# EAGLE schematic avr-atmega328p-pth (EAGLE 9.5.2)
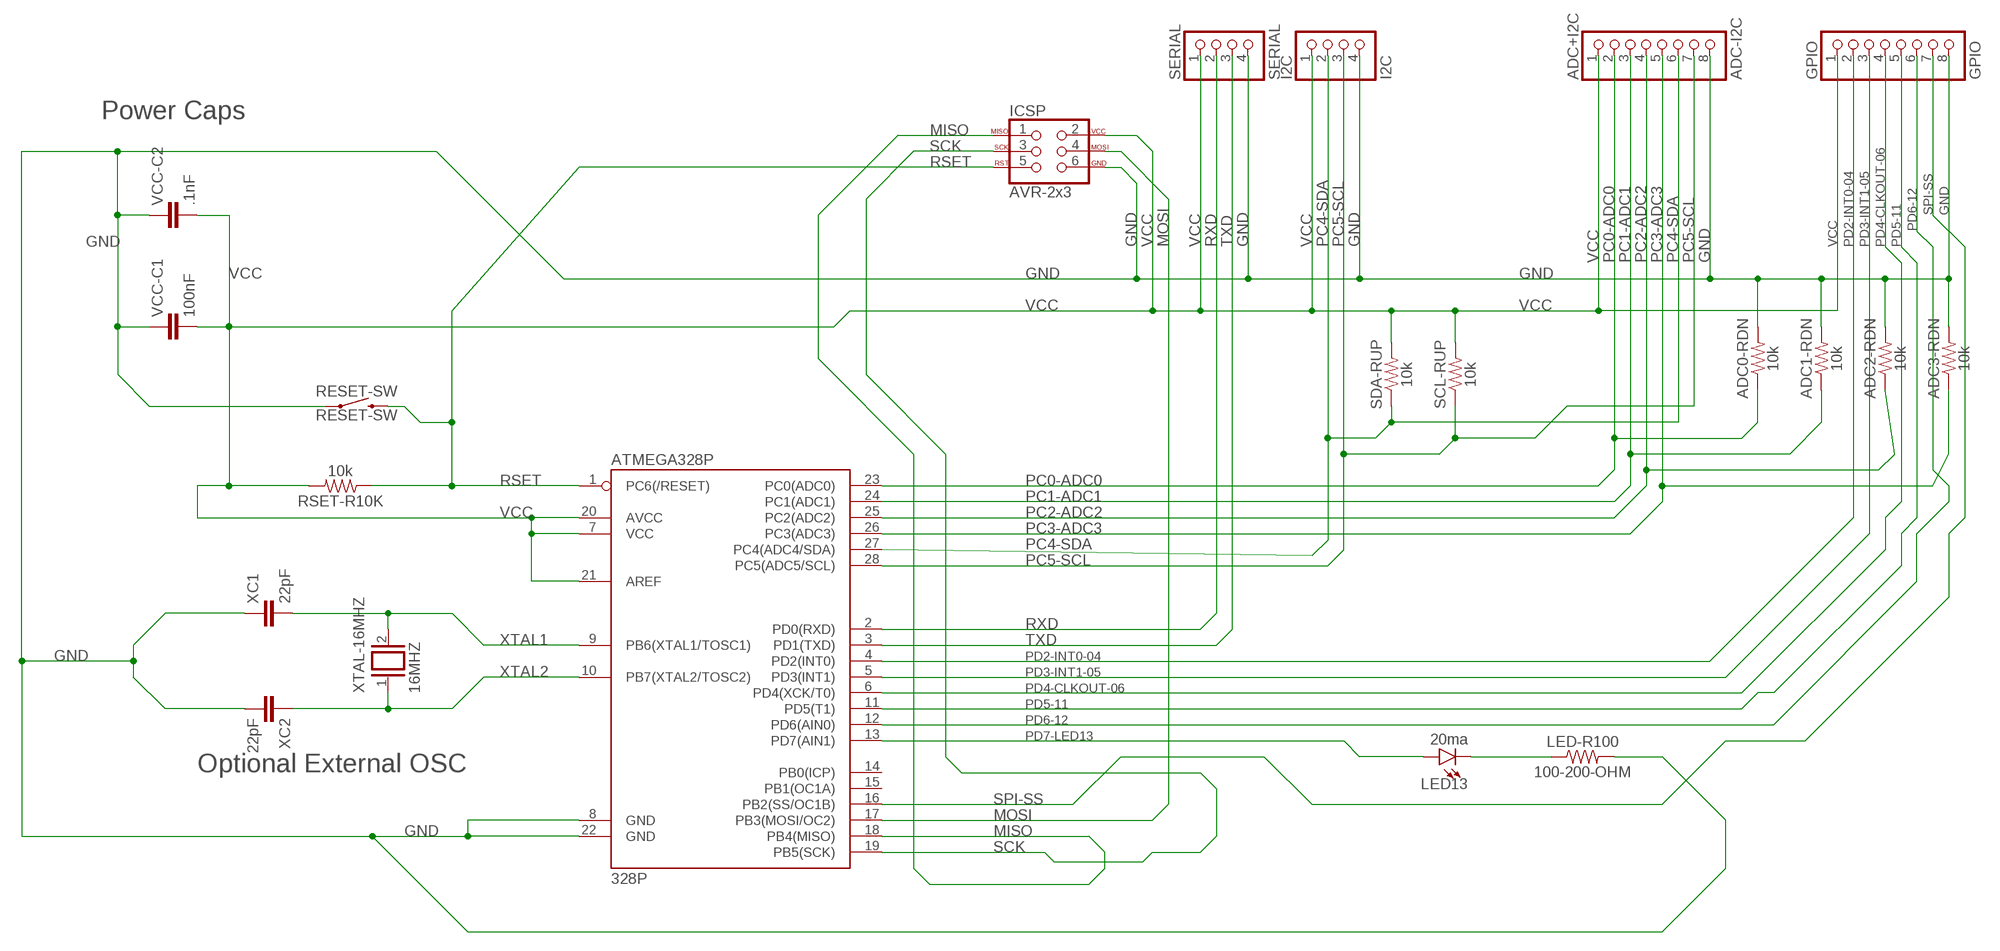
[diagram p0: schematic, sheet 1]

## Parts
ADC0-RDN  10k  10KOHM-HORIZ-1/4W-5%  [AXIAL-0.3]
ADC1-RDN  10k  10KOHM-HORIZ-1/4W-5%  [AXIAL-0.3]
ADC2-RDN  10k  10KOHM-HORIZ-1/4W-5%  [AXIAL-0.3]
ADC3-RDN  10k  10KOHM-HORIZ-1/4W-5%  [AXIAL-0.3]
ADC+I2C  ADC-I2C  PINHD-1X8  [1X08]
ATMEGA328P  328P  ATMEGA328P_PDIP  [DIP28]
GPIO  GPIO  PINHD-1X8  [1X08]
I2C  I2C  PINHD-1X4  [1X04]
ICSP  AVR-2x3  AVR_SPI_PROG_3X22X3_LOCK  [2X3_LOCK]
LED13  20ma  LED3MM  [LED_3MM]
LED-R100  100-200-OHM  10KOHM-HORIZ-1/4W-5%  [AXIAL-0.3]
RESET-SW  RESET-SW  MOMENTARY-SWITCH-SPST-PTH-6.0MM  [TACTILE_SWITCH_PTH_6.0MM]
RSET-R10K  10k  10KOHM-HORIZ-1/4W-5%  [AXIAL-0.3]
SCL-RUP  10k  10KOHM-HORIZ-1/4W-5%  [AXIAL-0.3]
SDA-RUP  10k  10KOHM-HORIZ-1/4W-5%  [AXIAL-0.3]
SERIAL  SERIAL  PINHD-1X4  [1X04]
VCC-C1  100nF  22PF-PTH-2.54MM-200V-5%  [CAP-PTH-2.54]
VCC-C2  .1nF  22PF-PTH-2.54MM-200V-5%  [CAP-PTH-2.54]
XC1  22pF  22PF-PTH-2.54MM-200V-5%  [CAP-PTH-2.54]
XC2  22pF  22PF-PTH-2.54MM-200V-5%  [CAP-PTH-2.54]
XTAL-16MHZ  16MHZ  XTAL/S  [QS]

## Nets
GND [POWER]: ADC0-RDN.P$2 ADC1-RDN.P$2 ADC2-RDN.P$2 ADC3-RDN.P$2 ADC+I2C.8 ATMEGA328P.8(GND) ATMEGA328P.22(GND) GPIO.8 I2C.4 ICSP.6 LED-R100.P$2 RESET-SW.1 SERIAL.4 VCC-C1.1 VCC-C2.1 XC1.1 XC2.2
MISO [POWER]: ATMEGA328P.18(PB4(MISO)) ICSP.1
MOSI [POWER]: ATMEGA328P.17(PB3(MOSI/OC2)) ICSP.4
N$2 [POWER]: LED13.K(C) LED-R100.P$1
PC0-ADC0 [POWER]: ADC0-RDN.P$1 ADC+I2C.2 ATMEGA328P.23(PC0(ADC0))
PC1-ADC1 [POWER]: ADC1-RDN.P$1 ADC+I2C.3 ATMEGA328P.24(PC1(ADC1))
PC2-ADC2 [POWER]: ADC2-RDN.P$1 ADC+I2C.4 ATMEGA328P.25(PC2(ADC2))
PC3-ADC3 [POWER]: ADC3-RDN.P$1 ADC+I2C.5 ATMEGA328P.26(PC3(ADC3))
PC4-SDA [POWER]: ADC+I2C.6 ATMEGA328P.27(PC4(ADC4/SDA)) I2C.2 SDA-RUP.P$1
PC5-SCL [POWER]: ADC+I2C.7 ATMEGA328P.28(PC5(ADC5/SCL)) I2C.3 SCL-RUP.P$1
PD2-INT0-04: ATMEGA328P.4(PD2(INT0)) GPIO.2
PD3-INT1-05: ATMEGA328P.5(PD3(INT1)) GPIO.3
PD4-CLKOUT-06: ATMEGA328P.6(PD4(XCK/T0)) GPIO.4
PD5-11: ATMEGA328P.11(PD5(T1)) GPIO.5
PD6-12: ATMEGA328P.12(PD6(AIN0)) GPIO.6
PD7-LED13 [POWER]: ATMEGA328P.13(PD7(AIN1)) LED13.A
RSET [POWER]: ATMEGA328P.1(PC6(/RESET)) ICSP.5 RESET-SW.3 RSET-R10K.P$1
RXD [POWER]: ATMEGA328P.2(PD0(RXD)) SERIAL.2
SCK [POWER]: ATMEGA328P.19(PB5(SCK)) ICSP.3
SPI-SS [POWER]: ATMEGA328P.16(PB2(SS/OC1B)) GPIO.7
TXD [POWER]: ATMEGA328P.3(PD1(TXD)) SERIAL.3
VCC [POWER]: ADC+I2C.1 ATMEGA328P.7(VCC) ATMEGA328P.20(AVCC) ATMEGA328P.21(AREF) GPIO.1 I2C.1 ICSP.2 RSET-R10K.P$2 SCL-RUP.P$2 SDA-RUP.P$2 SERIAL.1 VCC-C1.2 VCC-C2.2
XTAL1: ATMEGA328P.9(PB6(XTAL1/TOSC1)) XC1.2 XTAL-16MHZ.2
XTAL2: ATMEGA328P.10(PB7(XTAL2/TOSC2)) XC2.1 XTAL-16MHZ.1
Unconnected: ATMEGA328P.14(PB0(ICP)) ATMEGA328P.15(PB1(OC1A))

## Notes on the sheet
- Power Caps
- Optional External OSC

## Library data of the parts
ADC0-RDN ADC1-RDN ADC2-RDN ADC3-RDN RSET-R10K SCL-RUP SDA-RUP = SparkFun-Resistors:10KOHM: 10kΩ resistor A resistor is a passive two-terminal electrical component that implements electrical resistance as a circuit element. Resistors act to reduce current flow, and, at the same time, act to lower voltage levels within circuits. - Wikipedia; PROD_ID: RES-09435
ADC+I2C GPIO = pinhead:PINHD-1X8: PIN HEADER
ATMEGA328P = SparkFun-IC-Microcontroller:ATMEGA328P_PDIP: Atmel 328P Through hole ATMEGA328P uC used in the Arduino 32kb flash, 1k EEPROM, 2k SRAM Datasheet <http://www.sparkfun.com/datasheets/Components/SMD/ATMega328.pdf> SparkFun Products Storefront component: AVR 28 Pin 20MHz 32K 6A/D - ATMega328P <https://www.sparkfun.com/products/9061> (COM-09061) SparkFun Simon Says - Through-Hole Soldering Kit <https://www.sparkfun.com/products/10547> (KIT-10547) SparkFun Learn to Solder - Simon Says <https://www.sparkfun.com/products/13708> (KIT-13708) SparkFun BigTime Watch Kit <https://www.sparkfun.com/products/11734> (KIT-11734) SparkFun ClockIt <https://www.sparkfun.com/products/10930> (KIT-10930) SparkFun Serial Enabled LCD Kit <https://www.sparkfun.com/products/10097> (LCD-10097) SparkFun Simon Tilts - Through Hole Soldering Kit <https://www.sparkfun.com/products/12634> (KIT-12634) SparkFun Frequency Counter Kit <https://www.sparkfun.com/products/10140> (KIT-10140) FabFM Radio Kit <https://www.sparkfun.com/products/11043> (KIT-11043) SparkFun Binary Blaster Kit <https://www.sparkfun.com/products/12037> (KIT-12037) SparkFun Metro-Gnome <https://www.sparkfun.com/products/9236> (KIT-09236) ATmega328 with Arduino Optiboot (Uno) <https://www.sparkfun.com/products/10524> (DEV-10524); PROD_ID: IC-09136
I2C SERIAL = pinhead:PINHD-1X4: PIN HEADER
ICSP = SparkFun-Connectors:AVR_SPI_PROG_3X2: AVR ISP 6 Pin This is the reduced ISP connector for AVR programming. Common on Arduino. This footprint will take up less PCB space and can be used with a 10-pin to 6-pin adapter such as SKU: BOB-08508 **Special note about "TEST_POINT" package. The stop mask is on the top side, so if you want your programming test points to be on the bottom of your board, make sure to place this package on the bottom side of the board. This also ensure that the orientation to program from the bottom side will be correct. SparkFun Products: SparkFun ISP Pogo Adapter <https://www.sparkfun.com/products/11591> - NS Tiny AVR Programmer <https://www.sparkfun.com/products/11801> -PTH
LED13 = SparkFun-LED:LED: LED (Generic) Standard schematic elements and footprints for 5mm, 3mm, 1206, and 0603 sized LEDs. Generic LEDs with no color specified.; PROD_ID: DIO-08794
LED-R100 = SparkFun-Resistors:10KOHM: 10kΩ resistor A resistor is a passive two-terminal electrical component that implements electrical resistance as a circuit element. Resistors act to reduce current flow, and, at the same time, act to lower voltage levels within circuits. - Wikipedia; PROD_ID: RES-09435; VALUE: 10k
RESET-SW = SparkFun-Switches:MOMENTARY-SWITCH-SPST: Momentary Switch (Pushbutton) - SPST Normally-open (NO) SPST momentary switches (buttons, pushbuttons). Variants PTH-12MM - 12mm square, through-hole Momentary Pushbutton Switch - 12mm Square <https://www.sparkfun.com/products/9190> (COM-09190) PTH-6.0MM, PTH-6.0MM-KIT - 6.0mm square, through-hole Mini Pushbutton Switch <https://www.sparkfun.com/products/97> (COM-00097) KIT package intended for soldering kit's - only one side of pads' copper is exposed. PTH-RIGHT-ANGLE-KIT - Right-angle, through-hole Right Angle Tactile Button <https://www.sparkfun.com/products/10791> - Used on SparkFun BigTime Watch Kit <https://www.sparkfun.com/products/11734> SMD-12MM - 12mm square, surface-mount Tactile Button - SMD (12mm) <https://www.sparkfun.com/products/12993> (COM-12993) Used on SparkFun PicoBoard <https://www.sparkfun.com/products/11888> SMD-4.5MM - 4.5mm Square Trackball Switch Used on SparkFun Blackberry Trackballer Breakout <https://www.sparkfun.com/products/13169> SMD-4.6MMX2.8MM - 4.60mm x 2.80mm, surface mount Used on SparkFun SAMD21 Mini Breakout <https://www.sparkfun.com/products/13664> SMD-5.2MM, SMD-5.2-REDUNDANT - 5.2mm square, surface-mount Mini Pushbutton Switch - SMD <https://www.sparkfun.com/products/8720> (COM-08720) Used on Arduino Pro Mini <https://www.sparkfun.com/products/11114> REDUNDANT package connects both switch circuits together SMD-6.0X3.5MM - 6.0 x 3.5mm, surface mount Momentary Reset Switch SMD <https://www.sparkfun.com/products/8229> (COM-08229) SMD-6.2MM-TALL - 6.2mm square, surface mount Tactile Button - SMD (6mm) <https://www.sparkfun.com/products/12992> Used on SparkFun Digital Sandbox <https://www.sparkfun.com/products/12651> SMD-RIGHT-ANGLE - Right-angle, surface mount Used on SparkFun Block for Intel® Edison - Arduino <https://www.sparkfun.com/products/13036>; PROD_ID: SWCH-08441; SF_SKU: COM-00097
VCC-C1 VCC-C2 = SparkFun-Capacitors:22PF: 22pF ceramic capacitors A capacitor is a passive two-terminal electrical component used to store electrical energy temporarily in an electric field.; PROD_ID: CAP-09128; VALUE: 22pF
XC1 XC2 = SparkFun-Capacitors:22PF: 22pF ceramic capacitors A capacitor is a passive two-terminal electrical component used to store electrical energy temporarily in an electric field.; PROD_ID: CAP-09128
XTAL-16MHZ = special:XTAL/S: CRYSTAL

## Net classes
0 default: width 0.305 mm
1 POWER: width 0.406 mm